# Altium project STM32_Custom_PCB.PrjPcb
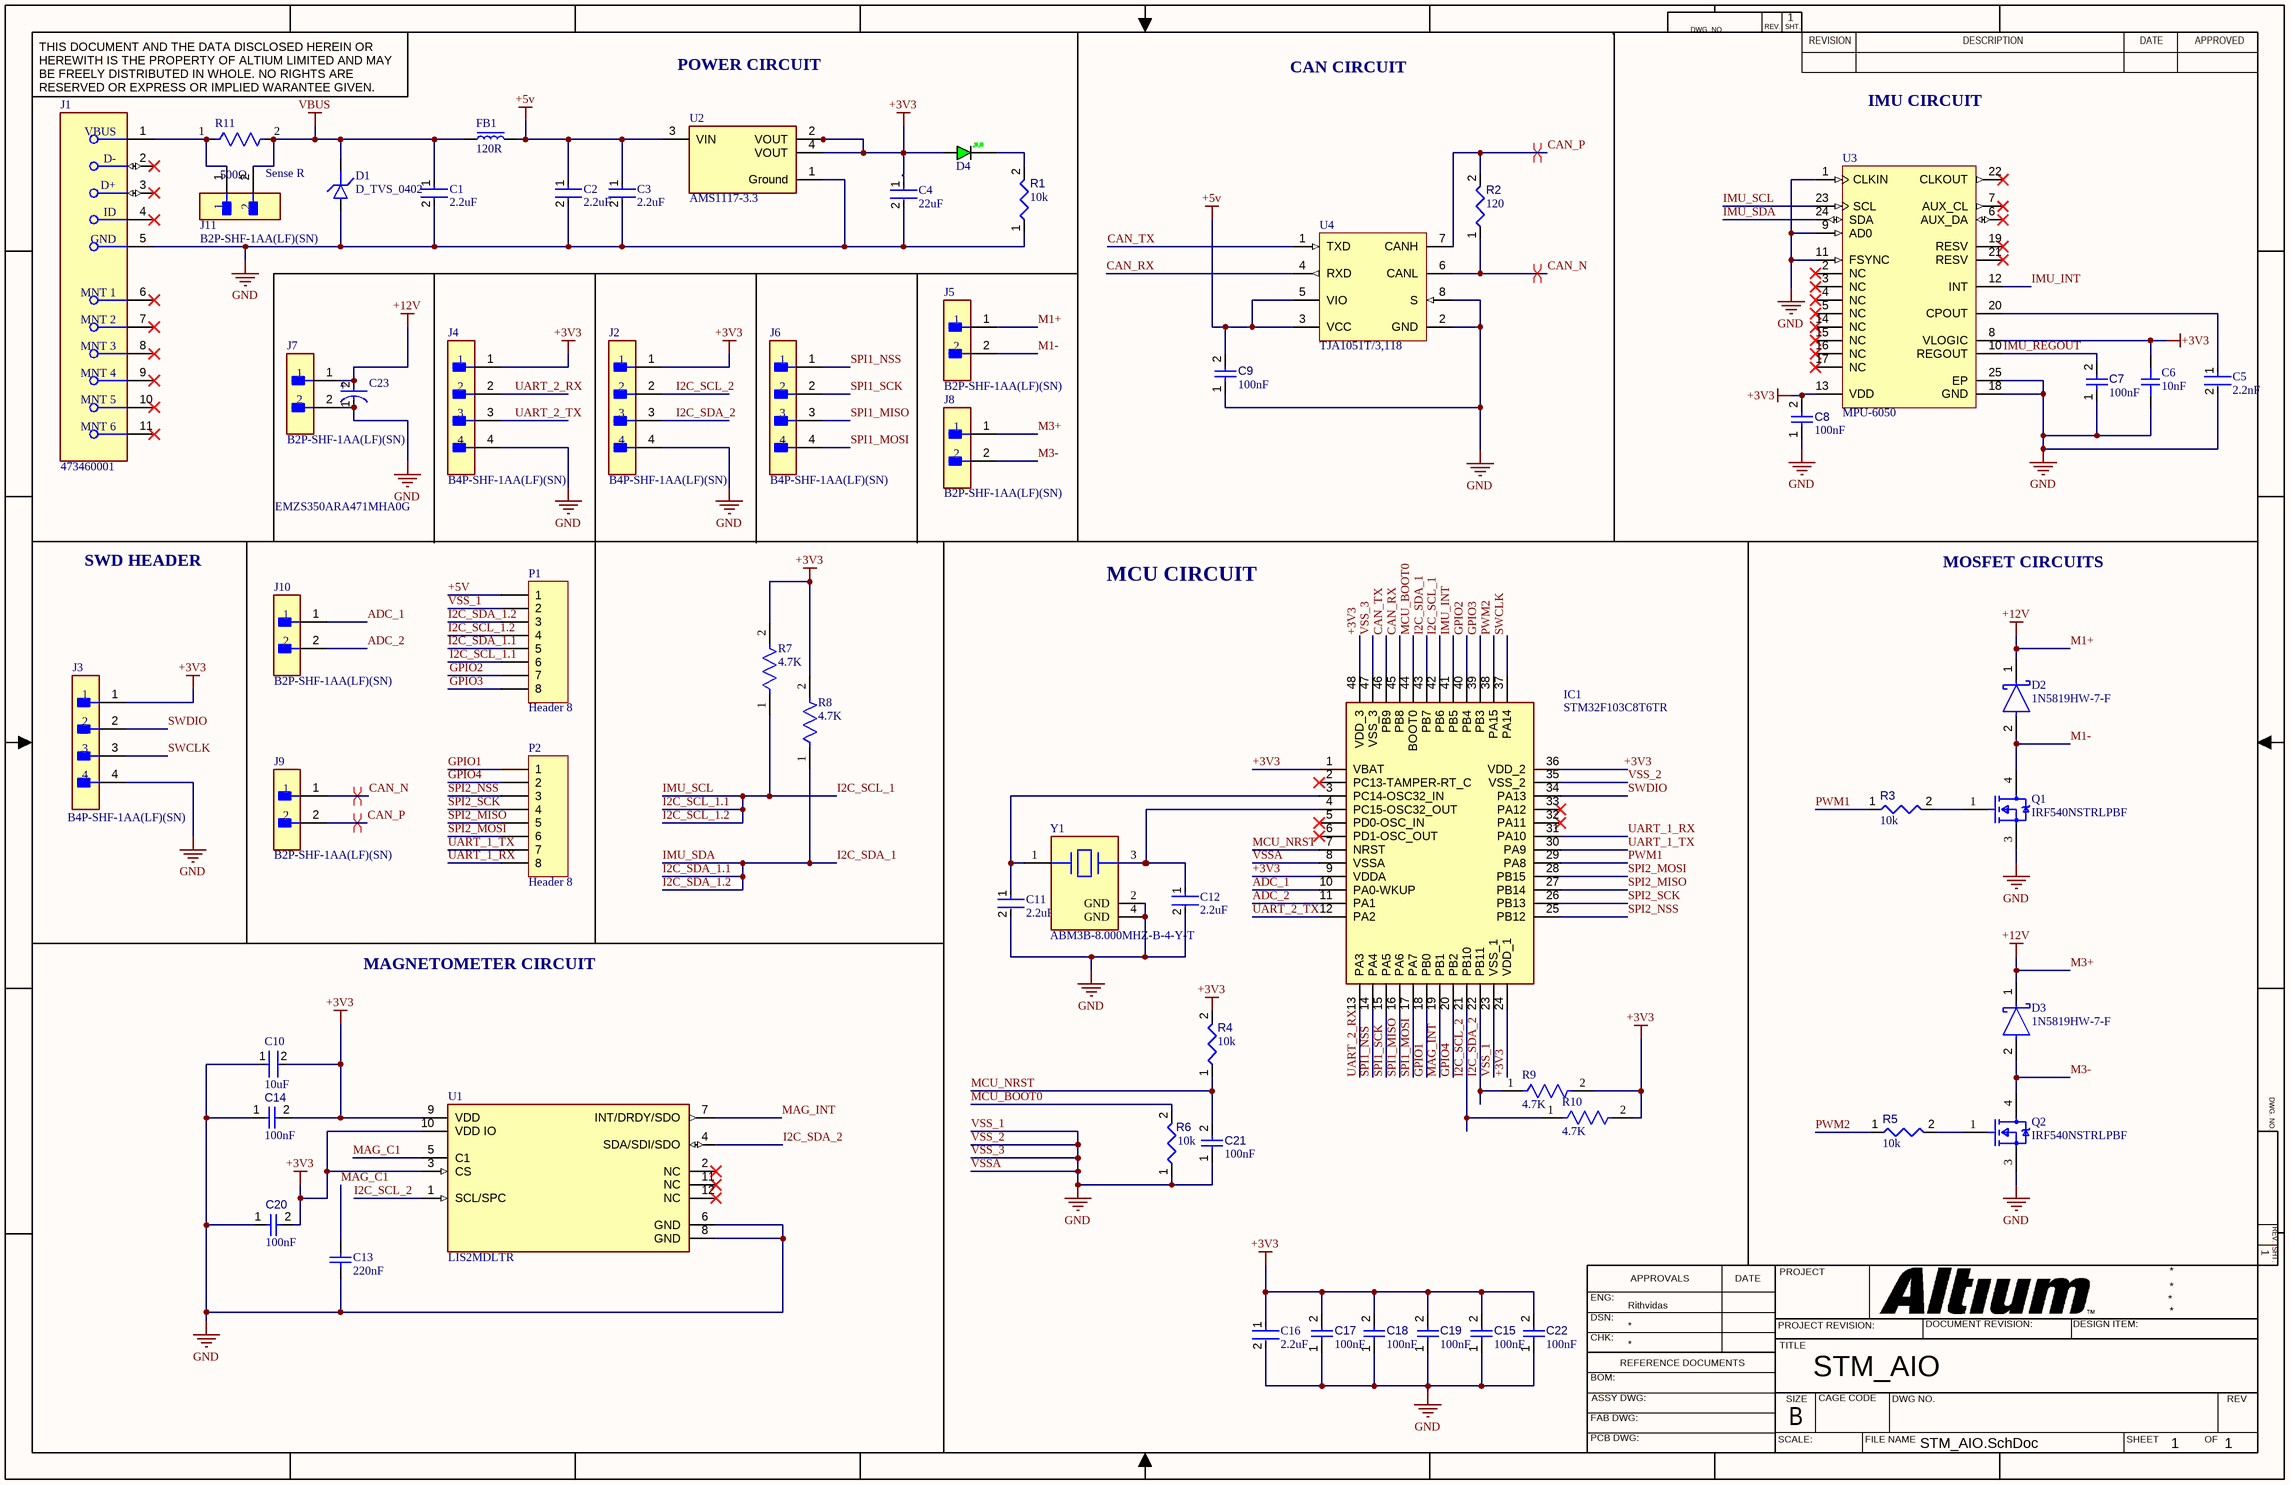
[diagram p0: STM_AIO.SchDoc]
1 sheet, 60 parts. Net scope: global (net labels, ports and power ports of the same name join across sheets).
Board file: STM_AIO.PcbDoc

## Sheet STM_AIO.SchDoc: STM_AIO
size 431 x 279 mm; Engineer: Rithvidas; Revision: 4; SheetNumber: 1; SheetTotal: 1

### Parts
C1  2.2uF  [FP-CL10-IPC_A]
C2  2.2uF  [FP-CL10-IPC_A]
C3  2.2uF  [FP-CL10-IPC_A]
C4  22uF  [FP-CL10-IPC_B]
C5  2.2nF  [FP-CL10-IPC_C]
C6  10nF  [CAP_0603]
C7  value 100nF  [CAPC1608X90X40NL10T20]  (hidden comment: Capacitor 100 nF +/-10% 50 V 0603)
C8  value 100nF  [CAPC1608X90X40NL10T20]  (hidden comment: Capacitor 100 nF +/-10% 50 V 0603)
C9  value 100nF  [CAPC1608X90X40NL10T20]  (hidden comment: Capacitor 100 nF +/-10% 50 V 0603)
C10  10uF  [FP-CC0603-0_15-0_95-IPC_B]
C11  2.2uF  [FP-CL10-IPC_A]
C12  2.2uF  [FP-CL10-IPC_A]
C13  220nF  [CAPC1608X95X40LL15T15]
C14  value 100nF  [CAPC1608X90X40NL10T20]  (hidden comment: Capacitor 100 nF +/-10% 50 V 0603)
C15  value 100nF  [CAPC1608X90X40NL10T20]  (hidden comment: Capacitor 100 nF +/-10% 50 V 0603)
C16  2.2uF  [FP-CL10-IPC_A]
C17  value 100nF  [CAPC1608X90X40NL10T20]  (hidden comment: Capacitor 100 nF +/-10% 50 V 0603)
C18  value 100nF  [CAPC1608X90X40NL10T20]  (hidden comment: Capacitor 100 nF +/-10% 50 V 0603)
C19  value 100nF  [CAPC1608X90X40NL10T20]  (hidden comment: Capacitor 100 nF +/-10% 50 V 0603)
C20  value 100nF  [CAPC1608X90X40NL10T20]  (hidden comment: Capacitor 100 nF +/-10% 50 V 0603)
C21  value 100nF  [CAPC1608X90X40NL10T20]  (hidden comment: Capacitor 100 nF +/-10% 50 V 0603)
C22  value 100nF  [CAPC1608X90X40NL10T20]  (hidden comment: Capacitor 100 nF +/-10% 50 V 0603)
C23  EMZS350ARA471MHA0G  [FP-MZS-HA0-A-MFG]
D1  D_TVS_0402  [D_0402]
D2  1N5819HW-7-F  [FP-SOD123-IPC_A]
D3  1N5819HW-7-F  [FP-SOD123-IPC_A]
D4  GREEN  [LED_0603_GREEN]  (value not drawn)
FB1  120R  [FB_0603]
IC1  STM32F103C8T6TR  [QFP50P900X900X160-48N]
J1  473460001  [FP-473460001-MFG]
J2  B4P-SHF-1AA(LF)(SN)  [FP-B4P-SHF-1AA_LF_SN-MFG]
J3  B4P-SHF-1AA(LF)(SN)  [FP-B4P-SHF-1AA_LF_SN-MFG]
J4  B4P-SHF-1AA(LF)(SN)  [FP-B4P-SHF-1AA_LF_SN-MFG]
J5  B2P-SHF-1AA(LF)(SN)  [FP-B2P-SHF-1AA_LF_SN-MFG]
J6  B4P-SHF-1AA(LF)(SN)  [FP-B4P-SHF-1AA_LF_SN-MFG]
J7  B2P-SHF-1AA(LF)(SN)  [FP-B2P-SHF-1AA_LF_SN-MFG]
J8  B2P-SHF-1AA(LF)(SN)  [FP-B2P-SHF-1AA_LF_SN-MFG]
J9  B2P-SHF-1AA(LF)(SN)  [FP-B2P-SHF-1AA_LF_SN-MFG]
J10  B2P-SHF-1AA(LF)(SN)  [FP-B2P-SHF-1AA_LF_SN-MFG]
J11  B2P-SHF-1AA(LF)(SN)  [FP-B2P-SHF-1AA_LF_SN-MFG]
P1  Header 8  [HDR1X8]
P2  Header 8  [HDR1X8]
Q1  IRF540NSTRLPBF  [FP-PG-TO263-3-MFG]
Q2  IRF540NSTRLPBF  [FP-PG-TO263-3-MFG]
R1  value 10k  [RESC1608X55X25ML10T15]  (hidden comment: Resistor 10k +/-1% 0603 100 mW)
R2  value 120  [RESC0603(1608)_L]  (hidden comment: Resistor 120R +/-5 % 0603 0.1 W)
R3  value 10k  [RESC1608X55X25ML10T15]  (hidden comment: Resistor 10k +/-1% 0603 100 mW)
R4  value 10k  [RESC1608X55X25ML10T15]  (hidden comment: Resistor 10k +/-1% 0603 100 mW)
R5  value 10k  [RESC1608X55X25ML10T15]  (hidden comment: Resistor 10k +/-1% 0603 100 mW)
R6  value 10k  [RESC1608X55X25ML10T15]  (hidden comment: Resistor 10k +/-1% 0603 100 mW)
R7  4.7K  [FP-TFCR0603-MFG]
R8  4.7K  [FP-TFCR0603-MFG]
R9  4.7K  [FP-TFCR0603-MFG]
R10  4.7K  [FP-TFCR0603-MFG]
R11  Sense R  [RESC16080X45_RT0603-0_55_MFG]
U1  LIS2MDLTR  [FP-LGA-12-DM00170568-MFG]
U2  AMS1117-3.3  [FP-AMS1117-IPC_C]
U3  MPU-6050  [IS-QFN-24_V]
U4  TJA1051T/3,118  [NXP-SOIC-8_L]
Y1  ABM3B-8.000MHZ-B-4-Y-T  [FP-ABM3B-MFG]

### Nets
+3V3: C4.1 C6.2 C8.2 C10.2 C14.2 C15.2 C16.1 C17.2 C18.2 C19.2 C20.2 C22.2 D4.A IC1.1(VBAT) IC1.9(VDDA) IC1.24(VDD_1) IC1.36(VDD_2) IC1.48(VDD_3) J2.1 J3.1 J4.1 R4.2 R7.2 R8.2 R9.2 R10.2 U1.3(CS) U1.9(VDD) U1.10(VDD_IO) U2.2(VOUT) U2.4(VOUT) U3.8(VLOGIC) U3.13(VDD)
+5V: C2.1 C3.1 C9.2 FB1.2 P1.1 U2.3(VIN) U4.3(VCC) U4.5(VIO)
M1+: C23.2(A) D2.1(C) D3.1(C) J5.1 J7.1 J8.1  [also labelled +12V, M3+]
VBUS: C1.1 D1.K FB1.1 J11.2 R11.2
VSS_1: C1.2 C2.2 C3.2 C4.2 C5.2 C6.1 C7.1 C8.1 C9.1 C10.1 C11.2 C12.2 C13.1 C14.1 C15.1 C16.2 C17.1 C18.1 C19.1 C20.1 C21.1 C22.1 C23.1(C) D1.A IC1.8(VSSA) IC1.23(VSS_1) IC1.35(VSS_2) IC1.47(VSS_3) J1.5(GND) J2.4 J3.4 J4.4 J7.2 P1.2 Q1.3(SOURCE) Q2.3(SOURCE) R1.1 R6.1 U1.6(GND) U1.8(GND) U2.1(Ground) U3.1(CLKIN) U3.9(AD0) U3.11(FSYNC) U3.18(GND) U3.25(EP) U4.2(GND) U4.8(S) Y1.2(GND) Y1.4(GND)  [also labelled GND, VSS_2, VSS_3, VSSA]
ADC_1: IC1.10(PA0-WKUP) J10.1
ADC_2: IC1.11(PA1) J10.2
CAN_N: J9.1 R2.1 U4.6(CANL)
CAN_P: J9.2 R2.2 U4.7(CANH)
CAN_RX: IC1.45(PB8) U4.4(RXD)
CAN_TX: IC1.46(PB9) U4.1(TXD)
GPIO1: IC1.18(PB0) P2.1
GPIO2: IC1.40(PB4) P1.7
GPIO3: IC1.39(PB3) P1.8
GPIO4: IC1.20(PB2) P2.2
I2C_SCL_1: IC1.42(PB6) P1.4 P1.6 R7.1 U3.23(SCL)  [also labelled I2C_SCL_1.1, I2C_SCL_1.2, IMU_SCL]
I2C_SCL_2: IC1.21(PB10) J2.2 R10.1 U1.1(SCL/SPC)
I2C_SDA_1: IC1.43(PB7) P1.3 P1.5 R8.1 U3.24(SDA)  [also labelled I2C_SDA_1.1, I2C_SDA_1.2, IMU_SDA]
I2C_SDA_2: IC1.22(PB11) J2.3 R9.1 U1.4(SDA/SDI/SDO)
IMU_INT: IC1.41(PB5) U3.12(INT)
IMU_REGOUT: C7.2 U3.10(REGOUT)
M1-: D2.2(A) J5.2 Q1.4(DRAIN)
M3-: D3.2(A) J8.2 Q2.4(DRAIN)
MAG_C1: C13.2 U1.5(C1)
MAG_INT: IC1.19(PB1) U1.7(INT/DRDY/SDO)
MCU_BOOT0: IC1.44(BOOT0) R6.2
MCU_NRST: C21.2 IC1.7(NRST) R4.1
PWM1: IC1.29(PA8) R3.1
PWM2: IC1.38(PA15) R5.1
SPI1_MISO: IC1.16(PA6) J6.3
SPI1_MOSI: IC1.17(PA7) J6.4
SPI1_NSS: IC1.14(PA4) J6.1
SPI1_SCK: IC1.15(PA5) J6.2
SPI2_MISO: IC1.27(PB14) P2.5
SPI2_MOSI: IC1.28(PB15) P2.6
SPI2_NSS: IC1.25(PB12) P2.3
SPI2_SCK: IC1.26(PB13) P2.4
SWCLK: IC1.37(PA14) J3.3
SWDIO: IC1.34(PA13) J3.2
UART_1_RX: IC1.31(PA10) P2.8
UART_1_TX: IC1.30(PA9) P2.7
UART_2_RX: IC1.13(PA3) J4.2
UART_2_TX: IC1.12(PA2) J4.3
NetC5_1: C5.1 U3.20(CPOUT)
NetC11_1: C11.1 IC1.3(PC14-OSC32_IN) Y1.1
NetC12_1: C12.1 IC1.4(PC15-OSC32_OUT) Y1.3
NetD4_K: D4.K R1.2
NetJ1_1: J1.1(VBUS) J11.1 R11.1
NetQ1_1: Q1.1(GATE) R3.2
NetQ2_1: Q2.1(GATE) R5.2

Not connected (* = marked no-connect by the designer): IC1 2(PC13-TAMPER-RT_C)* 5(PD0-OSC_IN)* 6(PD1-OSC_OUT)* 32(PA11)* 33(PA12)*; J1 2(D-)* 3(D+)* 4(ID)* 6(MNT_1)* 7(MNT_2)* 8(MNT_3)* 9(MNT_4)* 10(MNT_5)* 11(MNT_6)*; U1 2(NC)* 11(NC)* 12(NC)*; U3 2(NC)* 3(NC)* 4(NC)* 5(NC)* 6(AUX_DA)* 7(AUX_CL)* 14(NC)* 15(NC)* 16(NC)* 17(NC)* 19(RESV)* 21(RESV)* 22(CLKOUT)*

### Layout directives
differential pair; differential pair class *: CAN_N, CAN_P
differential pair: CAN_N, CAN_P

### Notes on the sheet
- POWER CIRCUIT
- CAN CIRCUIT
- IMU CIRCUIT
- SWD HEADER
- MOSFET CIRCUITS
- MCU CIRCUIT
- MAGNETOMETER CIRCUIT
- DWG. NO.
- REV.
- SHT.
- THIS DOCUMENT AND THE DATA DISCLOSED HEREIN OR HEREWITH IS THE PROPERTY OF ALTIUM LIMITED AND MAY BE FREELY DISTRIBUTED IN WHOLE. NO RIGHTS ARE RESERVED OR EXPRESS OR IMPLIED WARANTEE GIVEN.
- REVISION
- DESCRIPTION
- DATE
- APPROVED
- ENG:
- APPROVALS
- PROJECT
- DSN:
- CHK:
- REFERENCE DOCUMENTS
- PROJECT REVISION:
- TITLE
- DOCUMENT REVISION:
- DESIGN ITEM:
- BOM:
- FAB DWG:
- PCB DWG:
- ASSY DWG:
- SCALE:
- SIZE
- B
- CAGE CODE
- FILE NAME
- DWG NO.
- SHEET
- OF
- REV
- (in symbol CMP-33768-000018-1) +

### Library data of the parts
C1-C3 C11 C12 C16 = CMP-13271-000835-1: Cap Ceramic 2.2uF 16V X5R ±10% Pad SMD 0603 +85°C T/R; Case Code (Metric): 1608; Height: 0.8mm; Case/Package: 0603; Depth: 0.8mm; Capacitance: 2.2uF; Voltage Rating: 16V; Case Code (Imperial): 0603; Length: 1.6mm; Packaging: Tape and Reel; Material: Ceramic; Lead Free: Lead Free; Max Operating Temperature: 85°C; Contact Plating: Tin; Thickness: 0.035inch; Radiation Hardening: No; Tolerance: 10%; Min Operating Temperature: -55°C; Voltage: 16V; Dielectric: X5R; Mount: Surface Mount; Package Quantity: 4000; Width: 0.031inch; Voltage Rating (DC): 16V
C4 = CMP-13271-002755-1: Cap Ceramic 22uF 16V X5R ±20% Pad SMD 0603 +85°C T/R; Mount: Surface Mount; Packaging: Tape and Reel; Case Code (Imperial): 0603; Max Operating Temperature: 85°C; Capacitance: 22uF; Case/Package: 0603; Voltage Rating: 16V; Tolerance: 20%; Case Code (Metric): 1608; Min Operating Temperature: -55°C
C5 = CMP-13271-002956-1: Cap Ceramic 2.2nF 50V X7R ±10% Pad SMD 0603 +125°C T/R; Voltage: 25V; Voltage Rating (DC): 50V; Material: Ceramic; Length: 1.6mm; Depth: 0.8mm; Case Code (Imperial): 0603; Packaging: Tape and Reel; Lead Free: Lead Free; Radiation Hardening: No; Width: 0.031inch; Capacitance: 2.2nF; Package Quantity: 1; Thickness: 0.035inch; Contact Plating: Tin; Dielectric: X7R; Voltage Rating: 50V; Tolerance: 10%; Max Operating Temperature: 125°C; Min Operating Temperature: -55°C; Case/Package: 0603; Height: 0.8mm; Case Code (Metric): 1608; Mount: Surface Mount
C6 = CAP_0603: Capacitor SMD 0603; Manufacturer: *; Manufacturer Part Number: *; Distributor Link: *; LCSC: *; Rating: *; Dielectric: *
C7-C9 C14 C15 C17-C22 = CMP-001-00017-6: Chip Capacitor, 100 nF, +/- 10%, 50 V, 0603 (1608 Metric); Voltage Rating: 50V; Capacitor Type: Ceramic; Tolerance: 10%; Mounting Technology: SM; Max Operating Temperature: 125°C; RoHS Compliant: True; Pins: 2; Case/Package: 0603; Min Operating Temperature: -55°C
C10 = CMP-03422-001506-1: CAP CER 10UF 6.3V X5R 0603; Tolerance: 20%; Voltage: 4V; Depth: 0.8mm; Halogen Free: Halogen Free; Case Code (Metric): 1608; Height: 0.8mm; Voltage Rating (DC): 6.3V; Construction: Flat; Series: CC; Lead Free: Lead Free; Min Operating Temperature: -55°C; Capacitance: 10uF; Thickness: 0.035inch; Max Operating Temperature: 85°C; Termination: SMD/SMT; Length: 1.6mm; Resistor Type: Ceramic; Dielectric: X5R; Mount: Surface Mount; Width: 0.031inch; Case/Package: 0603; Packaging: Tape and Reel; Case Code (Imperial): 0603; Voltage Rating: 6.3V; Weight: 7.1E-05oz; Radiation Hardening: No; RoHS Compliant: Yes
C13 = CMP-2006-00068-1: Part Number: VJ0603Y224KXXCW1BC; Manufacturer: Vitramon
C23 = CMP-33768-000018-1: CAP ALUM 470UF 20% 35V SMD; Polarity: Polar; Life (Hours): 2000Hour; ESR (Equivalent Series Resistance): 80mR; Tolerance: 20%; Packaging: Cut Tape; Voltage Rating: 35V; Case/Package: Radial; Max Operating Temperature: 105°C; Capacitance: 470uF; Ratings: AEC-Q200; Min Operating Temperature: -55°C; Mount: Surface Mount
D1 = D_TVS_0402: Diode TVS / ESD 0402
D2 D3 = CMP-0303-00003-3: DIODE SCHOTTKY 40V 1A SOD123; Forward Voltage: 450mV; Capacitance: 110pF; Max Forward Surge Current (Ifsm): 25A; Peak Reverse Current: 50uA; Polarity: Standard; Element Configuration: Single; Max Power Dissipation: 450mW; Min Operating Temperature: -65°C; Package Quantity: 3000; Contact Plating: Tin; Weight: 0.000353oz; Max Repetitive Reverse Voltage (Vrrm): 40V; Max Reverse Voltage (DC): 40V; Height: 1.25mm; Average Rectified Current: 1A; Width: 1.7mm; Case/Package: SOD-123-2; Lead Free: Lead Free; Max Operating Temperature: 125°C; Current Rating: 1A; Termination: SMD/SMT; Forward Current: 1A; Radiation Hardening: No; Number of Pins: 2; Length: 2.85mm; Voltage Rating (DC): 40V; REACH SVHC: No SVHC; Peak Non-Repetitive Surge Current: 25A; Packaging: Tape and Reel; Output Current: 1A
D4 = LED_0603_GREEN: LED 0603 GREEN SMD
FB1 = FB_0603: Ferrite Bead SMD 0603; Manufacturer: *; Manufacturer Part Number: *; Distributor Link: *; LCSC: *
IC1 = STM32F103C8T6TR: Integrated Circuit; Manufacturer_Name: STMicroelectronics; Datasheet Link: http://media.digikey.com/pdf/Data%20Sheets/ST%20Microelectronics%20PDFS/STM32F103x8,B.pdf; Height: 1.6mm; Manufacturer_Part_Number: STM32F103C8T6TR; Mouser Part Number: 511-STM32F103C8T6TR; Mouser Price/Stock: https://www.mouser.co.uk/ProductDetail/STMicroelectronics/STM32F103C8T6TR?qs=5HwTSiuA5HDxFj62n06yag%3D%3D; Arrow Part Number: STM32F103C8T6TR; Arrow Price/Stock: https://www.arrow.com/en/products/stm32f103c8t6tr/stmicroelectronics?utm_currency=USD&region=nac
J1 = CMP-2000-05246-2: CONN RCPT USB2.0 MICRO B SMD R/A; Manufacturer: Molex; Conn Orientation: Right Angle; Is Female: yes; Shielding: true; Pitch: 0.65mm; Number Of Contacts: 5; Voltage Rating: 30V; Current Rating: 1.8A; Device Class L2: USB Connectors; Digikey Description: CONN RCPT USB2.0 MICRO B SMD R/A; Height: 2.945mm; RoHS: TRUE; ComponentLink2Description: Datasheet; Octopart: https://octopart.com/47346-0001-molex-7164928; Automotive: No; Package: 0; Category: Conn; Device Class L1: Connectors; Usb Standard: USB 2.0; Temperature: -30°C to +85°C; Temperature Range Low: -30°C; Footprint Url: https://www.molex.com/pdm_docs/sd/473460001_sd.pdf; ComponentLink2URL: https://www.molex.com/webdocs/datasheets/pdf/en-us/0473460001_IO_CONNECTORS.pdf; Lead Free: Yes; Manufacturer Part Number: 473460001; Contact Material: Gold,Nickel; Temperature Range High: +85°C; Device Class L3: unset
J2-J4 J6 = CMP-17439-000200-1: CONN HEADER VERT 4POS 2.5MM; Max Current Rating: 3A; Number of Positions: 4; Mated Stacking Heights: 14.9mm; Contact Resistance: 20mR; Max Voltage Rating (AC): 250V; Orientation: Straight; Contact Finish - Mating: TIN; Series: NH; Housing Material: Polyamide; Number of Rows: 1; Contact Material: Brass; Pitch: 2.5mm; Color: Natural; Termination: Solder; Fastening Type: Friction; Depth: 5.6mm; Max Operating Temperature: 85°C; Number of Contacts: 4; Packaging: Bulk; Housing Color: Natural; Insulation Material: Nylon; Current Rating: 3A; Contact Mating Length: 0.236inch; Contact Plating: Tin; Min Operating Temperature: -25°C; Contact Type: Male Pin; Contact Shape: Square; Insulation Color: Natural; Mount: Through Hole; Voltage Rating: 250V; Lead Free: Lead Free; Flammability Rating: UL94 V-0; Connector Type: Header
J5 J7-J11 = CMP-00028-00009-1: 2.5mm 2 1 ヘッダー Straight Solder 250VDC / 250VAC 3A 85℃ -25℃ Tin-Lead Over Copper 5.6mm 9.2mm; Number of Positions: 2; Max Voltage Rating (AC): 250V; Contact Resistance: 20mΩ; Connector Type: Male Pin; Insulation Resistance: 500MΩ; Height: 9.2mm; Max Operating Temperature: 85°C; Contact Mating Length: 5.9944mm; Orientation: Straight; Contact Plating: Copper, Tin; Pins: 2; Housing Color: White; Depth: 5.6mm; Mounting Technology: Through Hole; Contact Gender: Male; Color: Natural; Contact Material: Brass; Terminal Pitch: 2.5mm; RoHS: Compliant; Pitch: 2.5mm; Number of Rows: 1; Current Rating: 3A; Max Current Rating: 3A; Number of Contacts: 2; Lead Free: Lead Free; Fastening Type: Friction; Voltage Rating: 250V; Termination: Solder; Housing Material: Polyamide; Min Operating Temperature: -25°C; Lifecycle Status: Production
P1 P2 = Header 8: Header, 8-Pin; LatestRevisionDate: 17-Jul-2002; LatestRevisionNote: Re-released for DXP Platform.; Publisher: Altium Limited
Q1 Q2 = CMP-00196-65873407-1: IRF540NSTRLPBF Transistor MOSFET N Channel 100 Volt 33 Amp 3-Pin 2+ Tab D2pak Tape And Reel; Drain to Source Voltage (Vdss): 100V; Rise Time: 35ns; Resistance: 44MΩ; Gate to Source Voltage (Vgs): 20V; Turn-Off Delay Time: 39ns; Recovery Time: 170ns; Number of Elements: 1; Max Junction Temperature (Tj): 175°C; Nominal Vgs: 4V; Element Configuration: Single; Current Rating: 33A; Power Dissipation: 3.8W; Turn-On Delay Time: 11ns; Input Capacitance: 1.96nF; Rds On Max: 8.4mΩ; Min Operating Temperature: -55°C; Lead Free: Lead Free; Packaging: Bulk; Voltage Rating (DC): 100V; Radiation Hardening: No; Height: 4.826mm; Schedule B: 8541290080, 8541290080; Mount: Surface Mount; Drain to Source Breakdown Voltage: 100V; Number of Pins: 3; Contact Plating: Tin; NexarPartId: 65873407; Max Operating Temperature: 175°C; Continuous Drain Current (ID): 33A; Termination: SMD/SMT; On-State Resistance: 44mΩ; Threshold Voltage: 4V; RoHS: Compliant; Dual Supply Voltage: 100V; Max Power Dissipation: 3.8W; Lifecycle Status: NRND; Width: 9.65mm; Drain to Source Resistance: 44mΩ; Fall Time: 35ns; Case/Package: D2PAK; Length: 10.668mm; Number of Channels: 1; Package Quantity: 800; REACH SVHC: No SVHC
R1 R3-R6 = CMP-009-00017-5: Chip Resistor, 10 KOhm, +/- 1%, 01 W, -55 to 155 degC, 0603 (1608 Metric); Voltage Rating: 50V; Power: 100mW; RoHS Compliant: True; Min Operating Temperature: -55°C; Pins: 2; Case/Package: 0603; Mounting Technology: SM; Max Operating Temperature: 155°C; Tolerance: 1%
R2 = CMP-009-00176-3: Chip Resistor, 120 Ohms, +/-5 %, 0.1 W, -55 to 155 degC, 0603; Power: 100mW; Tolerance: 5%; Max Operating Temperature: 155°C; Pins: 2; Case/Package: 0603; Min Operating Temperature: -55°C
R7-R10 = CMP-250906-225181-1: RES Thin Film,  4.7kΩ, 1%, 0.1W, 50ppm/°C, 0603
R11 = CMP-00621-87214386-1: Fixed Resistor, Thin Film, 0.1W, 500ohm, 75V, 0.1% +/-Tol, 15ppm/Cel, Surface Mount, 0603; Temperature Coefficient: 15ppm/°C; Power Rating: 100mW; Resistance: 500Ω; ComponentLink1URL: http://www.yageo.com/; Min Operating Temperature: -55°C; ComponentLink1Description: Manufacturer URL; Tolerance: 0.1%; ComponentLink3URL: http://www.yageo.com/exep/pages/download/literatures/PYu-R_Mount_10.pdf; RoHS: Non-Compliant; Voltage Rating: 75V; Max Operating Temperature: 155°C; Height: 550µm; ComponentLink2URL: https://www.yageo.com/upload/media/product/productsearch/datasheet/rchip/PYu-RT_1-to-0.01_RoHS_L_15.pdf; Case/Package: 0603; Packaging: Tape & Reel; ComponentLink3Description: Package URL; Composition: Thin Film; ComponentLink2Description: Datasheet URL
U1 = CMP-12173-000002-1: SENSOR MR I2C/SPI 12LGA; Manufacturer: STMicroelectronics; Sensing Method: Magnetic; Min Supply Voltage: 1.71V; Sensor Output: I2C,SPI; Operating Supply Current: 50-200uA; Max Supply Voltage: 3.6V; Octopart: https://octopart.com/lis2mdltr-stmicroelectronics-81117311; RoHS: TRUE; Device Class L3: unset; Device Class L1: Sensors; ComponentLink2URL: https://www.st.com/resource/en/datasheet/lis2mdl.pdf; Automotive: No; Device Class L2: Magnetic Sensors; Lead Free: Yes; Temperature: -40°C to +85°C; Manufacturer Part Number: LIS2MDLTR; Temperature Range High: +85°C; Height: 0.7mm; Digikey Description: SENSOR MR I2C/SPI 12LGA; Category: IC; ComponentLink2Description: Datasheet; Package: LGA-12-DM00170568; Temperature Range Low: -40°C
U2 = CMP-209535-000001-1: LDO Voltage Regulators 1A, 3.3V; Manufacturer: Advanced Monolithic Systems; Dropout Voltage: 1.1V; Output Type: Fixed; Nominal Supply Current: 5mA; Max Power Dissipation: 1.2W; Max Supply Voltage: 15V; Number Of Outputs: 1; Standoff Height: 0.64mm; Max Junction Temp: +125°C; Height: 1.8mm; Package: AMS1117; Device Class L2: Power Management ICs; ComponentLink2Description: Datasheet; ComponentLink2URL: http://www.advanced-monolithic.com/pdf/ds1117.pdf; Category: IC; RoHS: TRUE; Automotive: No; Device Class L1: Integrated Circuits (ICs); Output Current: 1A; Device Class L3: Voltage Regulators - Linear; Temperature: -40°C to +125°C; Output Voltage: 3.3V; Manufacturer Part Number: AMS1117-3.3; Temperature Range Low: -40°C; Octopart: https://octopart.com/ams1117-3.3-advanced+monolithic+systems-25899300; Lead Free: Yes; Ipc Land Pattern Name: SOT229P700X180-4; Temperature Range High: +125°C
U3 = CMP-1753-00002-2: 3-Axis Gyroscope, Accelerometer and a Digital Motion Processor(TM) (DMP), 2.375 to 3.46 V, -40 to 85 degC, 24-Pin QFN, RoHS, Tape and Reel; Manufacturer: InvenSense; Featured Product: MPU-60506-Axis,IntegratedI²CSolution; Other Names: 1428-1007-2 / MPU6050; Sensor Type: MotionTracking; Online Catalog: MPU-6000™Series; Unit PriceUSD: Digital; Datasheet Version: Rev. 3.3, 05/2012; Category: Sensors,Transducers; Datasheet URL: http://datasheet.octopart.com/MPU-6050-InvenSense-datasheet-14421344.pdf; Family: Multifunction; Standard Package: 5,000; Manufacturer URL: http://www.invensense.com/; Output Type: Digital; Dynamic Catalog: MPU-6000™Series
U4 = CMP-2000-07245-1: High-Speed CAN Transceiver, 3 to 5 V, 8-Pin SOIC (SOT96-1), RoHS, Tape and Reel; Manufacturer: NXP; Power Down Mode: Normal/Silent; Rad Hardened: No; Number of Transceivers: 1; Supply Current: 70mA; Operating Supply Voltage (Max): 5.5V; Operating Supply Voltage (Typ): 5V; Operating Supply Voltage (Min): 4.5V; Standard Supported: ISO11898-2; Data Rate: 1Mbps; DELETED: Compliant; Operating Temperature (Min): -40C; Datasheet Version: Rev. 7, 01/2015; Pin Count: 8; Operating Temperature (Max): 125C; Package Description: 8-Pin Small Outline Integrated Circuit, Body 4.9 x 3.9 mm, Pitch 1.27 mm; Category: Transceiver; Packaging: TapeandReel; Mounting: SurfaceMount; Package Reference: SOT96-1; Operating Temperature Classification: Automotive; Mounting Technology: SurfaceMount; Package Type: SO; Manufacturer URL: http://www.nxp.com/; Datasheet URL: http://www.nxp.com/documents/data_sheet/TJA1051.pdf
Y1 = CMP-27762-003571-1: Crystal 8MHz ±30ppm 18pF SMD-4 5mm x 3.2mm; ESR (Equivalent Series Resistance): 200R; Mount: Surface Mount; Packaging: Tape and Reel; Min Operating Temperature: -20°C; Frequency Tolerance: 30ppm; Frequency Stability: 30ppm; Load Capacitance: 18pF; Length: 0.197inch; Weight: 0.001764oz; Package Quantity: 1000; Frequency: 8MHz; Case/Package: SMD/SMT; Width: 3.2mm; RoHS Compliant: Yes; Height: 0.043inch; Max Operating Temperature: 70°C